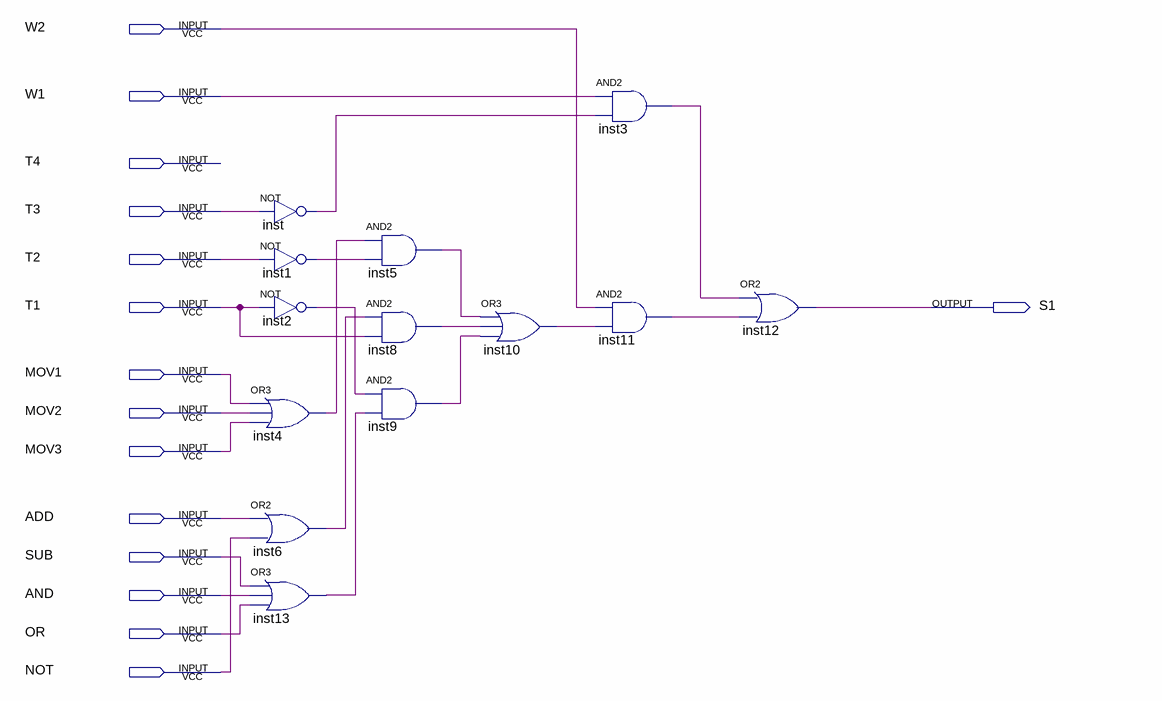
[diagram p0: schematic sheet]
// Quartus schematic S1.bdf as structural Verilog: 13 symbols, 15 pins
module S1 (
  input  W2,
  input  W1,
  input  T4,
  input  T3,
  input  T2,
  input  T1,
  input  MOV1,
  input  MOV2,
  input  MOV3,
  input  ADD,
  input  SUB,
  input  AND,
  input  OR,
  input  NOT,
  output S1
);

  wire inst1_out, inst2_out, inst3_out, inst4_out, inst5_out, inst6_out, inst8_out, inst9_out, inst10_out,
       inst11_out, inst13_out, inst_out;

  not inst (inst_out, T3);
  not inst1 (inst1_out, T2);
  not inst2 (inst2_out, T1);
  or inst4 (inst4_out, MOV1, MOV2, MOV3);
  or inst6 (inst6_out, ADD, NOT);
  or inst13 (inst13_out, SUB, AND, OR);
  and inst5 (inst5_out, inst4_out, inst1_out);
  and inst8 (inst8_out, inst6_out, T1);
  and inst9 (inst9_out, inst2_out, inst13_out);
  or inst10 (inst10_out, inst5_out, inst8_out, inst9_out);
  and inst3 (inst3_out, W1, inst_out);
  and inst11 (inst11_out, W2, inst10_out);
  or inst12 (S1, inst3_out, inst11_out);
endmodule
